# Altium schematic sheet LCD_SCH.SchDoc
size Letter
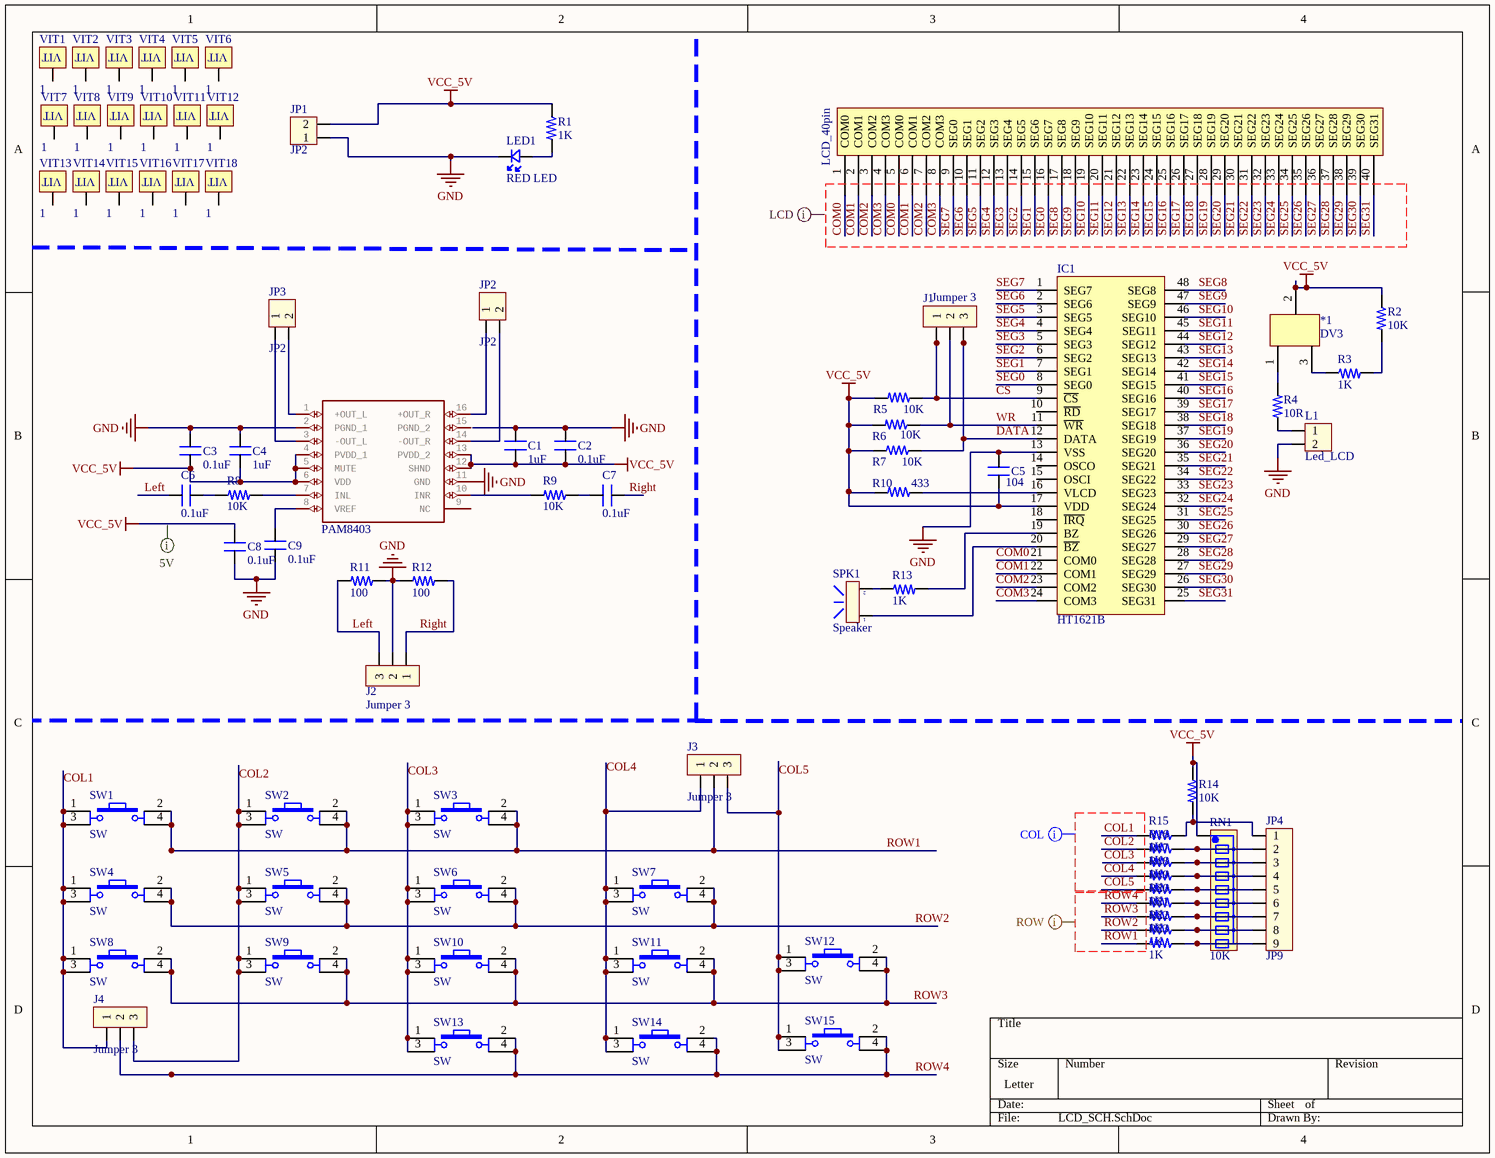
[diagram p0: LCD_SCH.SchDoc]

## Parts
*1  DV3  [SOT23B]
*2  PAM8403  [PAM8403]
C1  1uF  [CAP_0805]
C2  0.1uF  [CAP_0805]
C3  0.1uF  [CAP_0805]
C4  1uF  [CAP_0805]
C5  104  [CAP_0805]
C6  0.1uF  [CAP_0805]
C7  0.1uF  [CAP_0805]
C8  0.1uF  [CAP_0805]
C9  0.1uF  [CAP_0805]
IC1  HT1621B  [HT1621]
J1  Jumper 3  [JP3]
J2  Jumper 3  [JP3]
J3  Jumper 3  [JP3]
J4  Jumper 3  [JP3]
JP1  JP2  [CON2]
JP2  JP2  [CON2]
JP3  JP2  [CON2]
JP4  JP9  [CON9]
L1  Led_LCD  [Led_LCD]
LCD1  LCD_40pin  [LCD_40P]
LED1  RED LED  [LED_0805]
R1  1K  [RES_0805]
R2  10K  [RES_0805]
R3  1K  [RES_0805]
R4  10R  [RES_0805]
R5  10K  [RES_0805]
R6  10K  [RES_0805]
R7  10K  [RES_0805]
R8  10K  [RES_0805]
R9  10K  [RES_0805]
R10  433  [RES_0805]
R11  100  [RES_0805]
R12  100  [RES_0805]
R13  1K  [RES_0805]
R14  10K  [RES_0805]
R15  1K  [RES_0805]
R16  1K  [RES_0805]
R17  1K  [RES_0805]
R18  1K  [RES_0805]
R19  1K  [RES_0805]
R20  1K  [RES_0805]
R21  1K  [RES_0805]
R22  1K  [RES_0805]
R23  1K  [RES_0805]
RN1  10K  [RN8]
SPK1  Speaker  [SPK1]
SW1  SW  [SW4_1012]
SW2  SW  [SW4_1012]
SW3  SW  [SW4_1012]
SW4  SW  [SW4_1012]
SW5  SW  [SW4_1012]
SW6  SW  [SW4_1012]
SW7  SW  [SW4_1012]
SW8  SW  [SW4_1012]
SW9  SW  [SW4_1012]
SW10  SW  [SW4_1012]
SW11  SW  [SW4_1012]
SW12  SW  [SW4_1012]
SW13  SW  [SW4_1012]
SW14  SW  [SW4_1012]
SW15  SW  [SW4_1012]
VIT1  1  [VIT]
VIT2  1  [VIT]
VIT3  1  [VIT]
VIT4  1  [VIT]
VIT5  1  [VIT]
VIT6  1  [VIT]
VIT7  1  [VIT]
VIT8  1  [VIT]
VIT9  1  [VIT]
VIT10  1  [VIT]
VIT11  1  [VIT]
VIT12  1  [VIT]
VIT13  1  [VIT]
VIT14  1  [VIT]
VIT15  1  [VIT]
VIT16  1  [VIT]
VIT17  1  [VIT]
VIT18  1  [VIT]

## Nets
GND: *2.2(PGND_1) *2.11(GND) C1.1 C2.1 C3.2 C4.2 C5.2 C8.2 C9.2 IC1.13(VSS) J2.2 JP1.1 L1.2 LED1.K R11.1 R12.2
VCC_5V: *1.2 *2.4(PVDD_1) *2.5(MUTE) *2.6(VDD) *2.12(SHND) *2.13(PVDD_2) C1.2 C2.2 C3.1 C4.1 C5.1 C8.1 IC1.17(VDD) JP1.2 R1.2 R2.2 R5.1 R6.1 R7.1 R10.1 R14.2 RN1.1
COL1: J4.1 R15.1 SW1.1 SW1.3 SW4.1 SW4.3 SW8.1 SW8.3
COL2: J4.3 R16.1 SW2.1 SW2.3 SW5.1 SW5.3 SW9.1 SW9.3
COL3: R17.1 SW3.1 SW3.3 SW6.1 SW6.3 SW10.1 SW10.3 SW13.1 SW13.3
COL4: J3.1 R18.1 SW7.1 SW7.3 SW11.1 SW11.3 SW14.1 SW14.3
COL5: J3.3 R19.1 SW12.1 SW12.3 SW15.1 SW15.3
COM0: IC1.21(COM0) LCD1.1(COM0) LCD1.5(COM0)
COM1: IC1.22(COM1) LCD1.2(COM1) LCD1.6(COM1)
COM2: IC1.23(COM2) LCD1.3(COM2) LCD1.7(COM2)
COM3: IC1.24(COM3) LCD1.4(COM3) LCD1.8(COM3)
CS: IC1.9(~{CS}) J1.1 R5.2
DATA: IC1.12(DATA) J1.3 R7.2
Left: C6.2 J2.3 R11.2
Right: C7.1 J2.1 R12.1
ROW1: J3.2 R23.1 SW1.2 SW1.4 SW2.2 SW2.4 SW3.2 SW3.4
ROW2: R22.1 SW4.2 SW4.4 SW5.2 SW5.4 SW6.2 SW6.4 SW7.2 SW7.4
ROW3: R21.1 SW8.2 SW8.4 SW9.2 SW9.4 SW10.2 SW10.4 SW11.2 SW11.4 SW12.2 SW12.4
ROW4: J4.2 R20.1 SW13.2 SW13.4 SW14.2 SW14.4 SW15.2 SW15.4
SEG0: IC1.8(SEG0) LCD1.16(SEG7)
SEG1: IC1.7(SEG1) LCD1.15(SEG6)
SEG2: IC1.6(SEG2) LCD1.14(SEG5)
SEG3: IC1.5(SEG3) LCD1.13(SEG4)
SEG4: IC1.4(SEG4) LCD1.12(SEG3)
SEG5: IC1.3(SEG5) LCD1.11(SEG2)
SEG6: IC1.2(SEG6) LCD1.10(SEG1)
SEG7: IC1.1(SEG7) LCD1.9(SEG0)
SEG8: IC1.48(SEG8) LCD1.17(SEG8)
SEG9: IC1.47(SEG9) LCD1.18(SEG9)
SEG10: IC1.46(SEG10) LCD1.19(SEG10)
SEG11: IC1.45(SEG11) LCD1.20(SEG11)
SEG12: IC1.44(SEG12) LCD1.21(SEG12)
SEG13: IC1.43(SEG13) LCD1.22(SEG13)
SEG14: IC1.42(SEG14) LCD1.23(SEG14)
SEG15: IC1.41(SEG15) LCD1.24(SEG15)
SEG16: IC1.40(SEG16) LCD1.25(SEG16)
SEG17: IC1.39(SEG17) LCD1.26(SEG17)
SEG18: IC1.38(SEG18) LCD1.27(SEG18)
SEG19: IC1.37(SEG19) LCD1.28(SEG19)
SEG20: IC1.36(SEG20) LCD1.29(SEG20)
SEG21: IC1.35(SEG21) LCD1.30(SEG21)
SEG22: IC1.34(SEG22) LCD1.31(SEG22)
SEG23: IC1.33(SEG23) LCD1.32(SEG23)
SEG24: IC1.32(SEG24) LCD1.33(SEG24)
SEG25: IC1.31(SEG25) LCD1.34(SEG25)
SEG26: IC1.30(SEG26) LCD1.35(SEG26)
SEG27: IC1.29(SEG27) LCD1.36(SEG27)
SEG28: IC1.28(SEG28) LCD1.37(SEG28)
SEG29: IC1.27(SEG29) LCD1.38(SEG29)
SEG30: IC1.26(SEG30) LCD1.39(SEG30)
SEG31: IC1.25(SEG31) LCD1.40(SEG31)
WR: IC1.11(~{WR}) J1.2 R6.2
Net*1_1: *1.1 R4.2
Net*1_3: *1.3 R3.2
Net*2_1: *2.1(+OUT_L) JP3.2
Net*2_3: *2.3(-OUT_L) JP3.1
Net*2_7: *2.7(INL) R8.2
Net*2_8: *2.8(VREF) C9.1
Net*2_10: *2.10(INR) R9.1
Net*2_14: *2.14(-OUT_R) JP2.2
Net*2_16: *2.16(+OUT_R) JP2.1
NetC6_1: C6.1 R8.1
NetC7_2: C7.2 R9.2
NetIC1_16: IC1.16(VLCD) R10.2
NetIC1_19: IC1.19(BZ) R13.1
NetIC1_20: IC1.20(~{BZ}) SPK1.1
NetJP4_1: JP4.1 R14.1 R15.2
NetJP4_2: JP4.2 R16.2 RN1.2
NetJP4_3: JP4.3 R17.2 RN1.3
NetJP4_4: JP4.4 R18.2 RN1.4
NetJP4_5: JP4.5 R19.2 RN1.5
NetJP4_6: JP4.6 R20.2 RN1.6
NetJP4_7: JP4.7 R21.2 RN1.7
NetJP4_8: JP4.8 R22.2 RN1.8
NetJP4_9: JP4.9 R23.2 RN1.9
NetL1_1: L1.1 R4.1
NetLED1_A: LED1.A R1.1
NetR2_1: R2.1 R3.1
NetR13_2: R13.2 SPK1.2

Not connected (* = marked no-connect by the designer): *2 9(NC) 15(PGND_2); IC1 10(~{RD}) 14(OSCO) 15(OSCI) 18(~{IRQ}); VIT1 VIT1(1); VIT2 VIT1(1); VIT3 VIT1(1); VIT4 VIT1(1); VIT5 VIT1(1); VIT6 VIT1(1); VIT7 VIT1(1); VIT8 VIT1(1); VIT9 VIT1(1); VIT10 VIT1(1); VIT11 VIT1(1); VIT12 VIT1(1); VIT13 VIT1(1); VIT14 VIT1(1); VIT15 VIT1(1); VIT16 VIT1(1); VIT17 VIT1(1); VIT18 VIT1(1)

## Layout directives
mark named COL: COL1, COL2, COL3, COL4, COL5
mark named ROW: ROW1, ROW2, ROW3, ROW4
mark named LCD: COM0, COM1, COM2, COM3, SEG0, SEG1, SEG2, SEG3, SEG4, SEG5, SEG6, SEG7, SEG8, SEG9, SEG10, SEG11, SEG12, SEG13, SEG14, SEG15, SEG16, SEG17, SEG18, SEG19, SEG20, SEG21, SEG22, SEG23, SEG24, SEG25, SEG26, SEG27, SEG28, SEG29, SEG30, SEG31
mark named 5V: (no net found under the mark)

## Library data of the parts
C1 C4 = CAP_1uF-50V-5%-0805: 1µF ±5% 50V Ceramic Capacitor X7R 0805 (2012 Metric); Manufacturer: Yageo; Manufacturing Part Number: CC0805JKX7R9BB105; Case/Package: 0805 (2012 Metric); Supplier-1: Digikey; Supplier Part Number-1: 311-3498-1-ND
C2 C3 C5-C9 = CAP_0.1uF-50V-5%-0805: 0.1µF ±5% 50V Ceramic Capacitor X7R 0805 (2012 Metric); Manufacturer: KEMET; Manufacturing Part Number: C0805C104J5RACTU; Case/Package: 0805 (2012 Metric); Supplier-1: Digikey; Supplier Part Number-1: 399-1171-1-ND
IC1 = HT1621B: 5V - 256kHz - 1/4 Duty - 32X4 LCD - 3 Wire INTERFACE
J1-J4 = JP3: Value: J3
JP1-JP3 = Con2: Connector 2; Value: Connector 2
JP4 = Con9: Connector 9; Value: Connector 9
L1 = Led_LCD: Led LCD 5V; Value: Connector 2
LCD1 = LCD_40pin: Value: 4N35
LED1 = LED-RED_10mA-0805: Red 621nm LED Indication - Discrete 2V 0805 (2012 Metric); Manufacturer: Lite-On Inc.; Manufacturer Part Number: LTST-C170EKT; Case/ Package: 0805; Supplier-1: Digikey; Supplier Part Number-1: 160-1178-1-ND
R1 R3 R13 R15-R23 = RES_1K-0.125W-1%-0805: 1 kOhms ±1% 0.125W, 1/8W Chip Resistor 0805 (2012 Metric) Moisture Resistant Thick Film; Manufacturer: 垈㎵á; Manufacturer Part Number: RC0805FR-071KL; Case/Package: 0805; Supplier-1: Digikey; Supplier Part Number-1: 311-1.00KCRCT-ND
R2 R5-R9 R14 = RES_10K-0.125W-1%-0805: 10 kOhms ±1% 0.125W, 1/8W Chip Resistor 0805 (2012 Metric) Moisture Resistant Thick Film; Manufacturer: Yageo; Manufacturing Part Number: RC0805FR-0710KL; Case/Package: 0805; Supplier-1: Digikey; Supplier Part Number-1: 311-10.0KCRCT-ND
R4 = RES_1K-0.125W-1%-0805: Manufacturer: 垈㎵á; Manufacturer Part Number: RC0805FR-071KL; Case/Package: 0805; Supplier-1: Digikey; Supplier Part Number-1: 311-1.00KCRCT-ND
R10 = RES_10K-0.125W-1%-0805: 433 Ohms ±1% 0.125W, 1/8W Chip Resistor 0805 (2012 Metric) Moisture Resistant Thick Film; Manufacturer: Yageo; Manufacturing Part Number: RC0805FR-0710KL; Case/Package: 0805; Supplier-1: Digikey; Supplier Part Number-1: 311-10.0KCRCT-ND
R11 R12 = RES_0ohm-0.125W-1%-0805_1: 0Ohms ±1% 0.125W, 1/8W Chip Resistor 0805 (2012 Metric) Moisture Resistant Thick Film; Manufacturer: 垈㎵á; Manufacturer Part Number: RC0805FR-071KL; Case/Package: 0805; Supplier-1: Digikey; Supplier Part Number-1: 311-1.00KCRCT-ND
RN1 = RN8: Resistor 8 (Thanh); Value: Tro thanh 10K
SPK1 = SPK1: Speaker Chip; Value: Speaker Chip
SW1-SW15 = SW4: Switch button 4 pin; Value: Button chip 4 pin
VIT1-VIT18 = VIT: Oc Vit